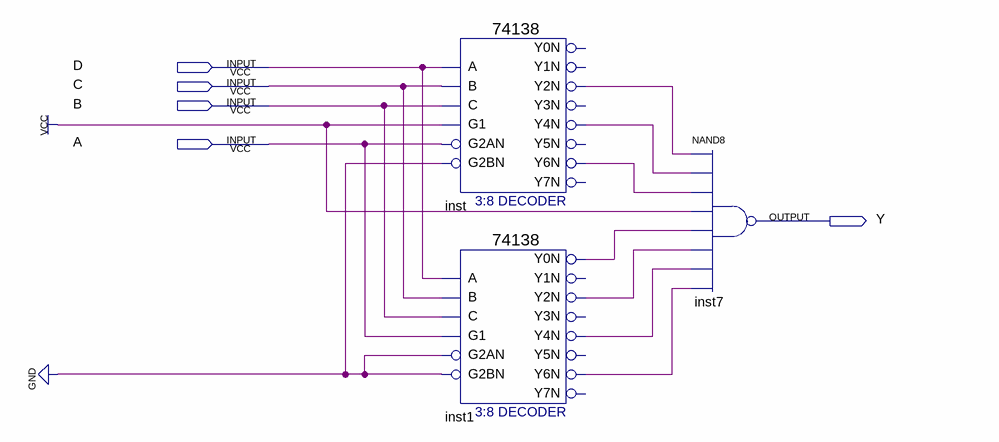
[diagram p0: schematic sheet]
// Quartus schematic lab2.bdf as structural Verilog: 3 symbols, 5 pins
module lab2 (
  input  D,
  input  C,
  input  B,
  input  A,
  output Y
);

  wire inst1_y0n, inst1_y2n, inst1_y4n, inst1_y6n, inst_y2n, inst_y4n, inst_y6n;

  \74138  inst (
    .A(D), .B(C), .G1(1'b1), .C(B), .G2AN(A), .G2BN(1'b0), .Y2N(inst_y2n), .Y4N(inst_y4n), .Y6N(inst_y6n));  // open: Y0N, Y1N, Y3N, Y5N, Y7N
  \74138  inst1 (
    .A(D), .B(C), .G1(A), .C(B), .G2AN(1'b0), .G2BN(1'b0), .Y0N(inst1_y0n), .Y2N(inst1_y2n), .Y4N(inst1_y4n),
    .Y6N(inst1_y6n));  // open: Y1N, Y3N, Y5N, Y7N
  nand inst7 (Y, inst_y2n, inst_y4n, inst_y6n, 1'b1, inst1_y0n, inst1_y2n, inst1_y4n, inst1_y6n);
endmodule
